# EAGLE design astroCACTUS (EAGLE 9.1.0)
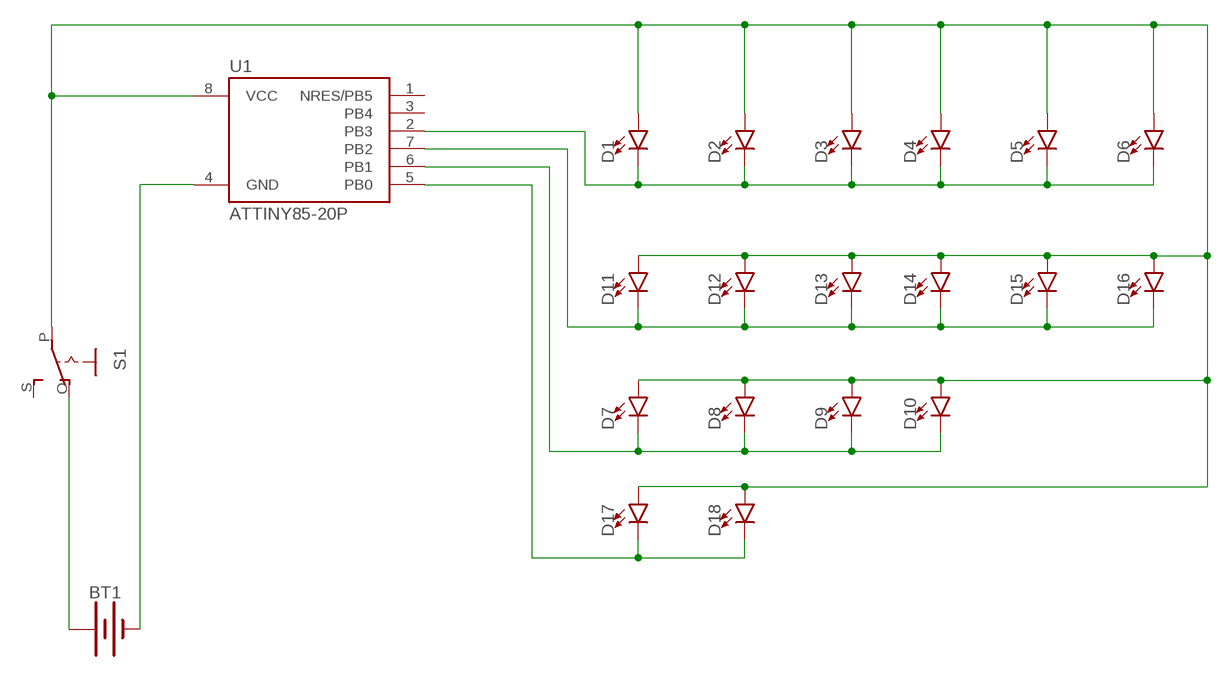
[diagram p0: schematic, sheet 1]

## Parts
BT1  BATTERY-20MM_PTH  [BATTCOM_20MM_PTH]
D1  LED3MM  [LED_3MM]
D2  LED3MM  [LED_3MM]
D3  LED3MM  [LED_3MM]
D4  LED3MM  [LED_3MM]
D5  LED3MM  [LED_3MM]
D6  LED3MM  [LED_3MM]
D7  LED3MM  [LED_3MM]
D8  LED3MM  [LED_3MM]
D9  LED3MM  [LED_3MM]
D10  LED3MM  [LED_3MM]
D11  LED3MM  [LED_3MM]
D12  LED3MM  [LED_3MM]
D13  LED3MM  [LED_3MM]
D14  LED3MM  [LED_3MM]
D15  LED3MM  [LED_3MM]
D16  LED3MM  [LED_3MM]
D17  LED3MM  [LED_3MM]
D18  LED3MM  [LED_3MM]
S1  EG1218S  [EG1218]
U1  ATTINY85-20P  [PDIP08_300MIL]

## Nets
N$1: D1.K(C) D2.K(C) D3.K(C) D4.K(C) D5.K(C) D6.K(C) U1.2(PB3)
N$2: BT1.1(+) S1.O
N$3: D11.K(C) D12.K(C) D13.K(C) D14.K(C) D15.K(C) D16.K(C) U1.7(PB2)
N$4: D7.K(C) D8.K(C) D9.K(C) D10.K(C) U1.6(PB1)
N$5: BT1.2(-) U1.4(GND)
N$6: D17.K(C) D18.K(C) U1.5(PB0)
N$31: D1.A D2.A D3.A D4.A D5.A D6.A D7.A D8.A D9.A D10.A D11.A D12.A D13.A D14.A D15.A D16.A D17.A D18.A S1.P U1.8(VCC)
Unconnected: S1.S U1.1(NRES/PB5) U1.3(PB4)

## Library data of the parts
BT1 = SparkFun-Batteries:BATTERY: Battery - Single Cell A variety of battery chemistries, sizes, and footprints. Device List: 20MM_PTH - Coin Cell Battery Holder - 20mm (PTH) <https://www.sparkfun.com/products/783> 6.8MM_PTH - Coin Cell Battery Holder - 6.8MM(SMD) <https://www.digikey.com/product-detail/en/seiko-instruments/MS621FE-FL11E/728-1057-ND/1889208?WT.srch=1&gclid=CNOQ5a6LzdQCFZS2wAodXCkE0g> 12MM_SMD - Coin Cell Battery Holder - 12mm (SMD) <https://www.sparkfun.com/products/10592> 12MM_PTH - Coin Cell Battery Holder - 12mm (PTH) <https://www.sparkfun.com/products/7948> 20MM_SMD - 20mm Coin Cell Battery Holder (SMD) (2 legs) Used on the Big Time Watch Kit <https://www.sparkfun.com/products/11734> 20MM_SMD_4LEGS - Coin Cell Battery Holder - 20mm (SMD) <https://www.sparkfun.com/products/11892> 20MM_SMD_4LEGS_OVERPASTE - Coin Cell Battery Holder - 20mm (SMD) <https://www.sparkfun.com/products/11892> (Over-paste on the legs) 24.5MM_PTH - Coin Cell Battery Holder - 24.5mm (PTH) <https://www.sparkfun.com/products/8863> 9V - 9V Battery Holder - PC Mount Used on the SparkFun SparkPunk Sound Kit <https://www.sparkfun.com/products/11177> and SparkFun SparkPunk Sequencer Kit <https://www.sparkfun.com/products/12707> 18650 - Battery Holder - 18650 (PTH) <https://www.sparkfun.com/products/13113> AA - Battery Holder - 1xAA (PTH) <https://www.sparkfun.com/products/7949> AAA - Battery Holder - 1xAAA (PTH) <https://www.sparkfun.com/products/12718> AA_KIT - Battery Holder - 1xAA (PTH) <https://www.sparkfun.com/products/7949> Special kit package - pads only have exposed copper on one side of the board. AAA_KIT - Battery Holder - 1xAAA (PTH) <https://www.sparkfun.com/products/12718> Special kit package - pads only have exposed copper on one side of the board.; PROD_ID: BATT-09031; SF_SKU: PRT-00783
D1-D18 = SparkFun-LED:LED: LED (Generic) Standard schematic elements and footprints for 5mm, 3mm, 1206, and 0603 sized LEDs. Generic LEDs with no color specified.; PROD_ID: DIO-08794
S1 = adafruit:EG1218: SLIDING SWITCH 0.1" spacing through hole, vertical SPDT slide switch http://www.ladyada.net/library/pcb/eaglelibrary.html
U1 = _hhn_attiny25_45_85:ATTINY85*: ATMEL ATtiny 85 Packages: P = PDIP 08 30mil S = SOIC 08 EIAJ 208mil Technologies Note: for complete ordering code (temp. range, finish, tape&reel etc.) see www.atmel.com • Supply Voltage: V = (1.8…5.5)V | [blank] = (2.7…5.5)V • Speed: 10 = 10 MHz | 20 = 20 MHz Author: Dipl.-Ing. FH Rainer Bayer HHN Hochschule Heilbronn (Heilbronn University), rainer.bayer@hs-heilbronn.de Ingenieurbüro ing-rb, mail@ing-rb.de

## Board
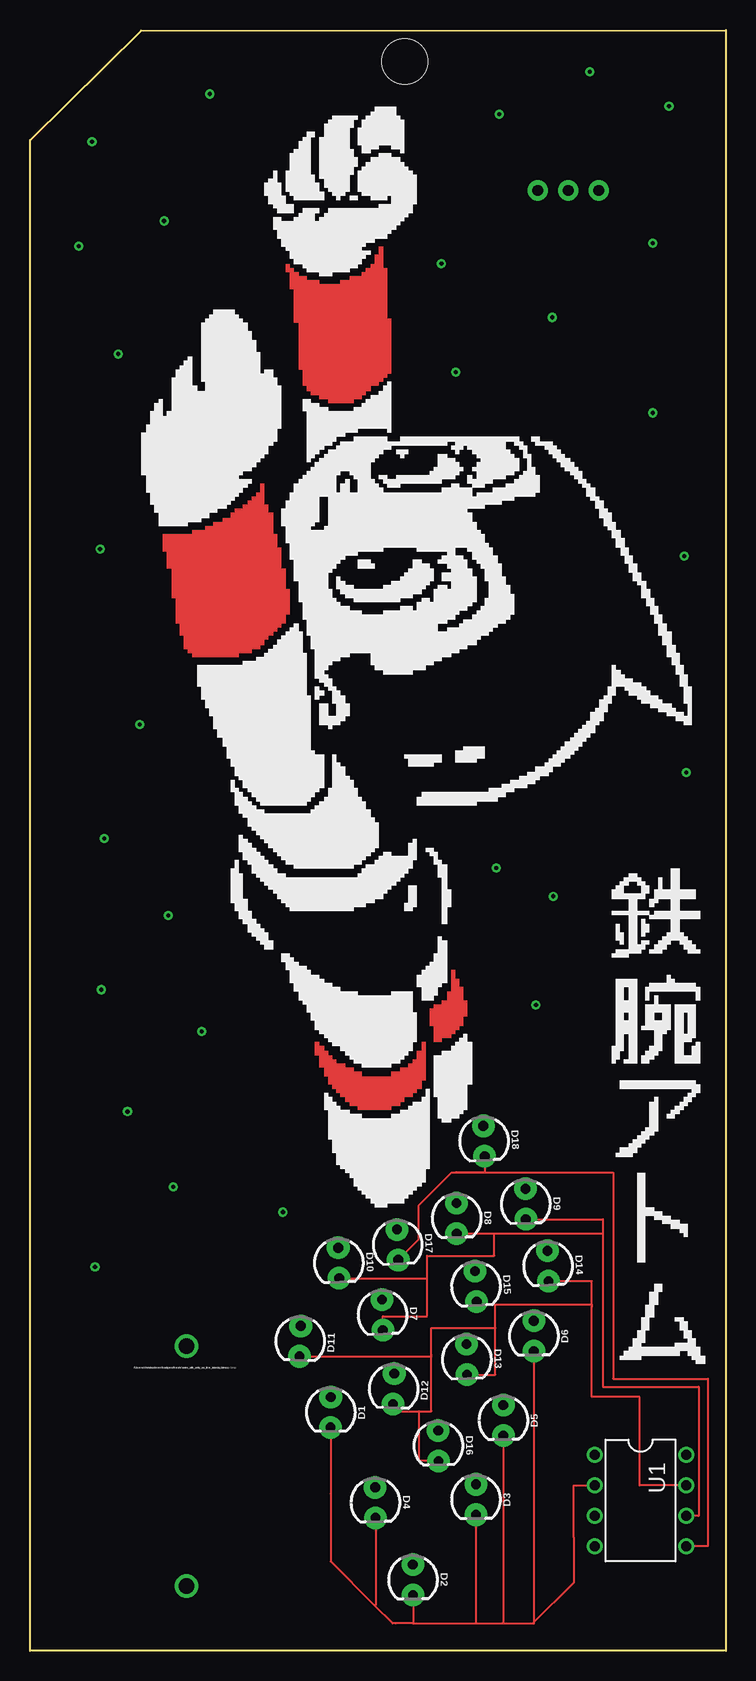
[diagram p1: board, top side]
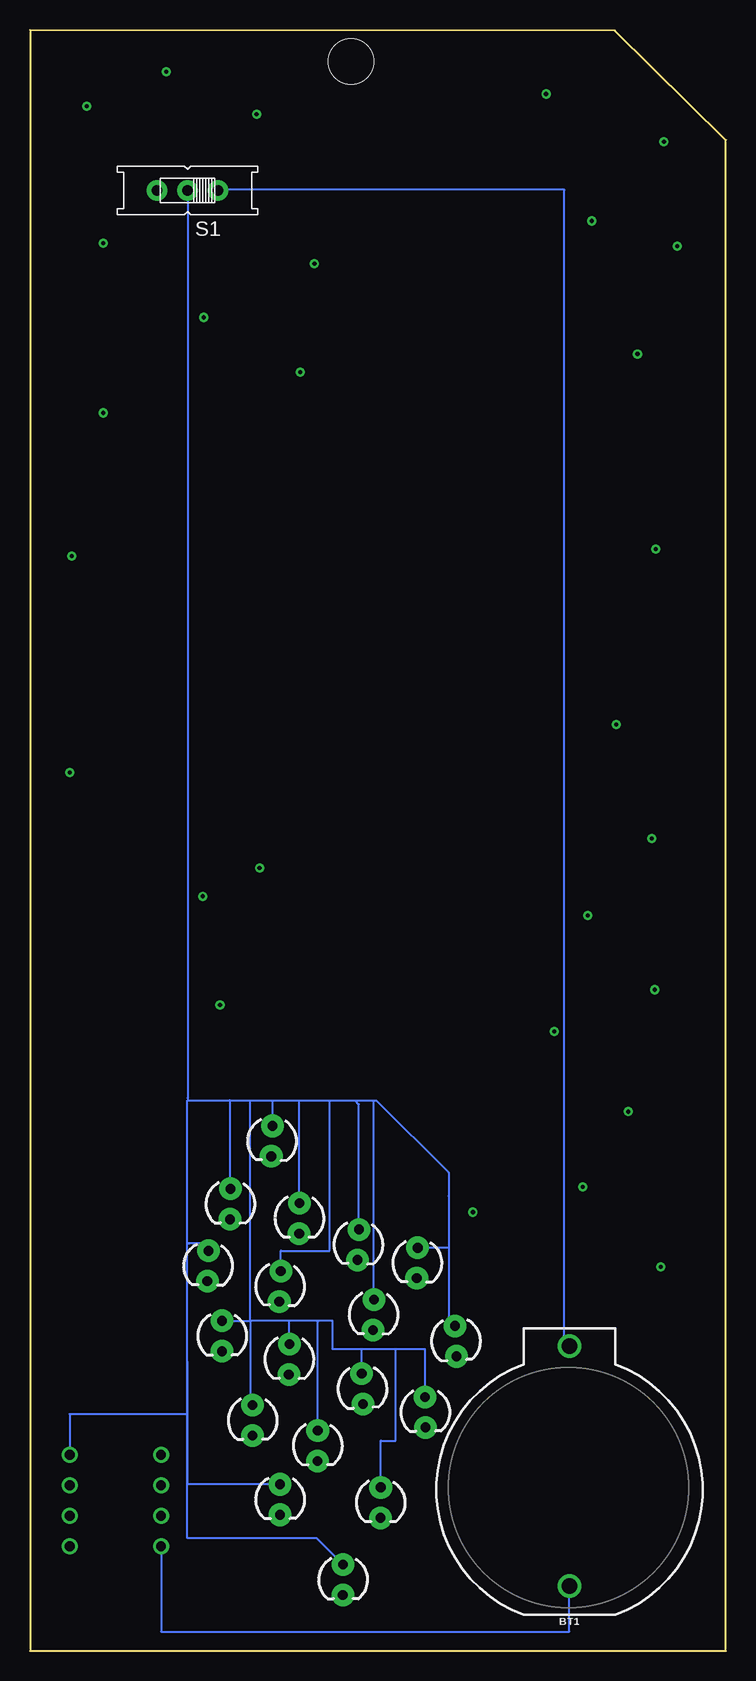
[diagram p2: board, bottom side, seen from below]

Size 57.99 x 135.11 mm. Coordinates in mm from the lower left corner, seen from the top.
Outline: 0,0 0,125.94 9.26,135.07 57.99,135.11 57.99,0 0,0
Copper layers (1*16): Top 0.035mm / dielectric 1.5mm / Bottom 0.035mm
Design rules "default": minimum track width 6mil, minimum drill 0.35mm, track to track 6mil, track to pad 6mil, pad to pad 6mil, via to via 6mil, smd to smd 6mil, copper to edge 40mil, drill to drill 6mil, minimum pad ring 10mil, minimum via ring 8mil, stop-mask expansion 4mil, vias tented up to drill 0mil, thermal gap 10mil
Holes 3.81 mm at 31.24,132.49

### Footprints (pad centres in the part's own frame; a part is rotated, then mirrored left to right if it is on the bottom)
BATTCOM_20MM_PTH = drill 1.3: 1 11.85,0; 2 -8.15,0
LED_3MM = drill 0.813 pad 1.88: A -1.27,0; K 1.27,0
EG1218 = drill 0.9 pad 1.676: O -2.54,0; P 0,0; S 2.54,0
PDIP08_300MIL = drill 0.813: 1 -3.81,-3.81; 2 -1.27,-3.81; 3 1.27,-3.81; 4 3.81,-3.81; 5 3.81,3.81; 6 1.27,3.81; 7 -1.27,3.81; 8 -3.81,3.81

### Placement (x,y rotation side)
BT1  13.03,13.55 90 bottom
D1  25.05,19.9 269.5 top
D2  31.91,5.93 270.4 top
D3  37.16,12.61 270 top
D4  28.78,12.36 270.7 top
D5  39.44,19.22 270 top
D6  41.98,26.24 270 top
D7  29.37,28.02 271.8 top
D8  35.55,36.06 270.6 top
D9  41.3,37.24 270.7 top
D10  25.73,32.33 271.7 top
D11  22.51,25.82 267.5 top
D12  30.3,21.84 267.5 top
D13  36.39,24.3 271.2 top
D14  43.17,32.08 272.1 top
D15  37.15,30.39 273 top
D16  34.02,17.1 270.5 top
D17  30.64,33.86 272.4 top
D18  37.83,42.49 272.5 top
S1  44.86,121.74 180 bottom
U1  50.87,12.53 270 top

### Tracks (layer width: path | path; a pad name or v marks a point on that pad's centre or on a via)
N$1
  Top 0.152: D1.K 25.04,13.12 | 25.04,13.12 25.04,7.45 25.06,7.45 28.7,3.81 | 31.92,2.29 37.25,2.29 | 37.25,2.29 39.37,2.29 | 39.37,2.29 41.91,2.29 | U1.2 45.29,13.8 45.29,9.48 45.29,5.67 41.91,2.29 | D2.K 31.92,2.29 | D3.K 37.16,2.29 37.25,2.29 | D5.K 39.44,2.29 39.37,2.29 | D6.K 41.98,2.29 41.91,2.29 | D1.K | 28.7,3.81 30.22,2.29 30.48,2.29 31.92,2.29 | D4.K 28.79,3.81 28.78,3.81 | 25.04,13.12 | 28.78,3.81 28.7,3.81 | 28.78,3.81 28.7,3.81
N$2
  Bottom 0.152: S1.O 42.28,121.79 13.46,121.79 13.46,25.82 BT1.1
N$3
  Top 0.152: U1.7 50.8,13.8 50.8,21.16 46.82,21.16 46.82,28.7 | 46.82,28.7 46.82,30.82 D14.K | D13.K 38.77,23.03 38.77,26.92 | 38.77,26.92 38.77,28.78 | 38.77,28.78 38.77,28.87 46.82,28.87 46.82,28.7 | 38.77,28.78 38.77,28.87 37.48,28.87 D15.K | D11.K 33.44,24.55 33.44,24.64 | 38.77,26.92 33.44,26.92 33.44,24.64 | 32.42,19.98 30.83,19.98 D12.K | 32.42,19.98 33.44,19.98 33.44,24.64 | D16.K 32.42,15.83 32.42,19.98
N$4
  Top 0.152: D9.K 47.75,35.98 47.75,34.79 | U1.6 55.72,11.26 55.72,22.01 47.75,22.01 47.75,34.71 47.75,34.79 | D8.K 38.69,34.79 | 38.69,34.79 47.75,34.79 | D7.K 29.41,27.9 33.1,27.9 33.1,31.07 | 33.1,31.07 33.1,32.93 38.6,32.93 38.69,32.93 38.69,34.79 | D10.K 33.1,31.07 | 47.75,34.79
N$5
  Bottom 0.152: U1.4 47.06,1.61 13.04,1.61 BT1.2 | BT1.2
N$6
  Top 0.152: U1.5 56.48,8.72 56.48,22.69 48.59,22.69 48.59,39.87 48.6,39.88 35.47,39.88 | 35.47,39.88 37.89,39.88 D18.K | 35.47,39.88 35.15,39.88 32.38,37.12 32.38,34.28 D17.K
N$7  (via drill 0.35)
  other vias: 39.11,128.09
N$9  (via drill 0.35)
  other vias: 34.29,115.64
N$10  (via drill 0.35)
  other vias: 43.51,111.16
N$11  (via drill 0.35)
  other vias: 51.9,117.34
N$12  (via drill 0.35)
  other vias: 51.9,103.2
N$14  (via drill 0.35)
  other vias: 53.25,128.77
N$16  (via drill 0.35)
  other vias: 54.52,91.26
N$17  (via drill 0.35)
  other vias: 35.47,106.58
N$19  (via drill 0.35)
  other vias: 46.65,131.64
N$20  (via drill 0.35)
  other vias: 11.17,119.2
N$24  (via drill 0.35)
  other vias: 5.16,125.8
N$25  (via drill 0.35)
  other vias: 14.98,129.78
N$26  (via drill 0.35)
  other vias: 7.37,108.11
N$27  (via drill 0.35)
  other vias: 4.06,117.08
N$28  (via drill 0.35)
  other vias: 5.84,91.85
N$29  (via drill 0.35)
  other vias: 9.14,77.21
N$30  (via drill 0.35)
  other vias: 6.18,67.73
N$31
  Bottom 0.152: S1.P 44.86,46.05 44.86,45.88 | 44.86,45.88 41.4,45.88 | 41.4,45.88 39.62,45.88 | 39.62,45.88 36.66,45.88 | 36.66,45.88 35.39,45.88 | 35.39,45.88 33.02,45.88 | 33.02,45.88 30.9,45.88 | 30.9,45.88 29.12,45.88 | 23.11,33.6 23.11,27.64 D11.A | 23.11,33.6 D10.A | D18.A 37.78,45.88 36.66,45.88 | D17.A 30.58,45.57 30.9,45.88 | D9.A 41.29,45.88 41.4,45.88 | D8.A 35.53,45.88 35.39,45.88 | D15.A 37.09,33.36 33.02,33.36 33.02,45.88 | D14.A 43.12,33.95 44.7,33.95 44.78,33.95 44.87,33.95 | 44.87,33.95 44.87,45.88 44.86,45.88 | D6.A 39.62,27.51 | 39.62,27.51 39.62,45.88 | D13.A 36.37,27.51 | 36.37,27.51 | 36.37,27.51 39.54,27.51 | 39.54,27.51 39.62,27.51 | D7.A 29.33,45.88 29.12,45.88 | 30.35,25.14 30.35,25.06 D12.A | 33.95,27.51 32.76,27.51 32.76,25.14 30.35,25.14 | 33.95,27.51 36.37,27.51 | D16.A 34.01,27.51 33.95,27.51 | D1.A 25.06,25.14 27.51,25.14 | 27.51,25.14 30.35,25.14 | D4.A 28.76,17.52 27.51,17.52 27.51,25.06 27.51,25.14 | 39.54,27.51 39.61,27.51 39.61,20.66 D5.A | 44.87,24.13 44.87,33.95 | 44.87,24.13 44.87,9.4 34.1,9.4 D2.A | 23.11,33.6 23.11,37.93 23.11,39.87 29.12,45.88 | D3.A 44.87,13.88 44.87,24.13 | 44.87,24.13 44.87,19.73 54.68,19.73 U1.8 | 44.87,23.28 | 44.87,23.28 44.87,24.13 | 44.87,23.28 44.87,22.6 | 44.87,22.6
N$32  (via drill 0.35)
  other vias: 11.51,61.29
N$33  (via drill 0.35)
  other vias: 8.13,44.95
N$34  (via drill 0.35)
  other vias: 5.93,55.11
N$35  (via drill 0.35)
  other vias: 42.16,53.84
N$36  (via drill 0.35)
  other vias: 43.6,62.9
N$37  (via drill 0.35)
  other vias: 54.69,73.23
N$38  (via drill 0.35)
  other vias: 14.31,51.64
N$39  (via drill 0.35)
  other vias: 5.42,32
N$40  (via drill 0.35)
  other vias: 11.94,38.69
N$41  (via drill 0.35)
  other vias: 21.08,36.57
N$42  (via drill 0.35)
  other vias: 38.86,65.27
(copper drawn outside any net)
  shapes: Top area x517

### Text on the board
tPlace: /Users/chrisbuckner/badges/fresh/astro_silk_only_no_fire_bitmap.bmp | /Users/chrisbuckner/badges/fresh/astro_silk_only_no_fire_words_bitmap.bmp
tStop: /Users/chrisbuckner/badges/fresh/astro_copper_only.bmp